# EAGLE design tetrabyte (EAGLE 7.7.0)
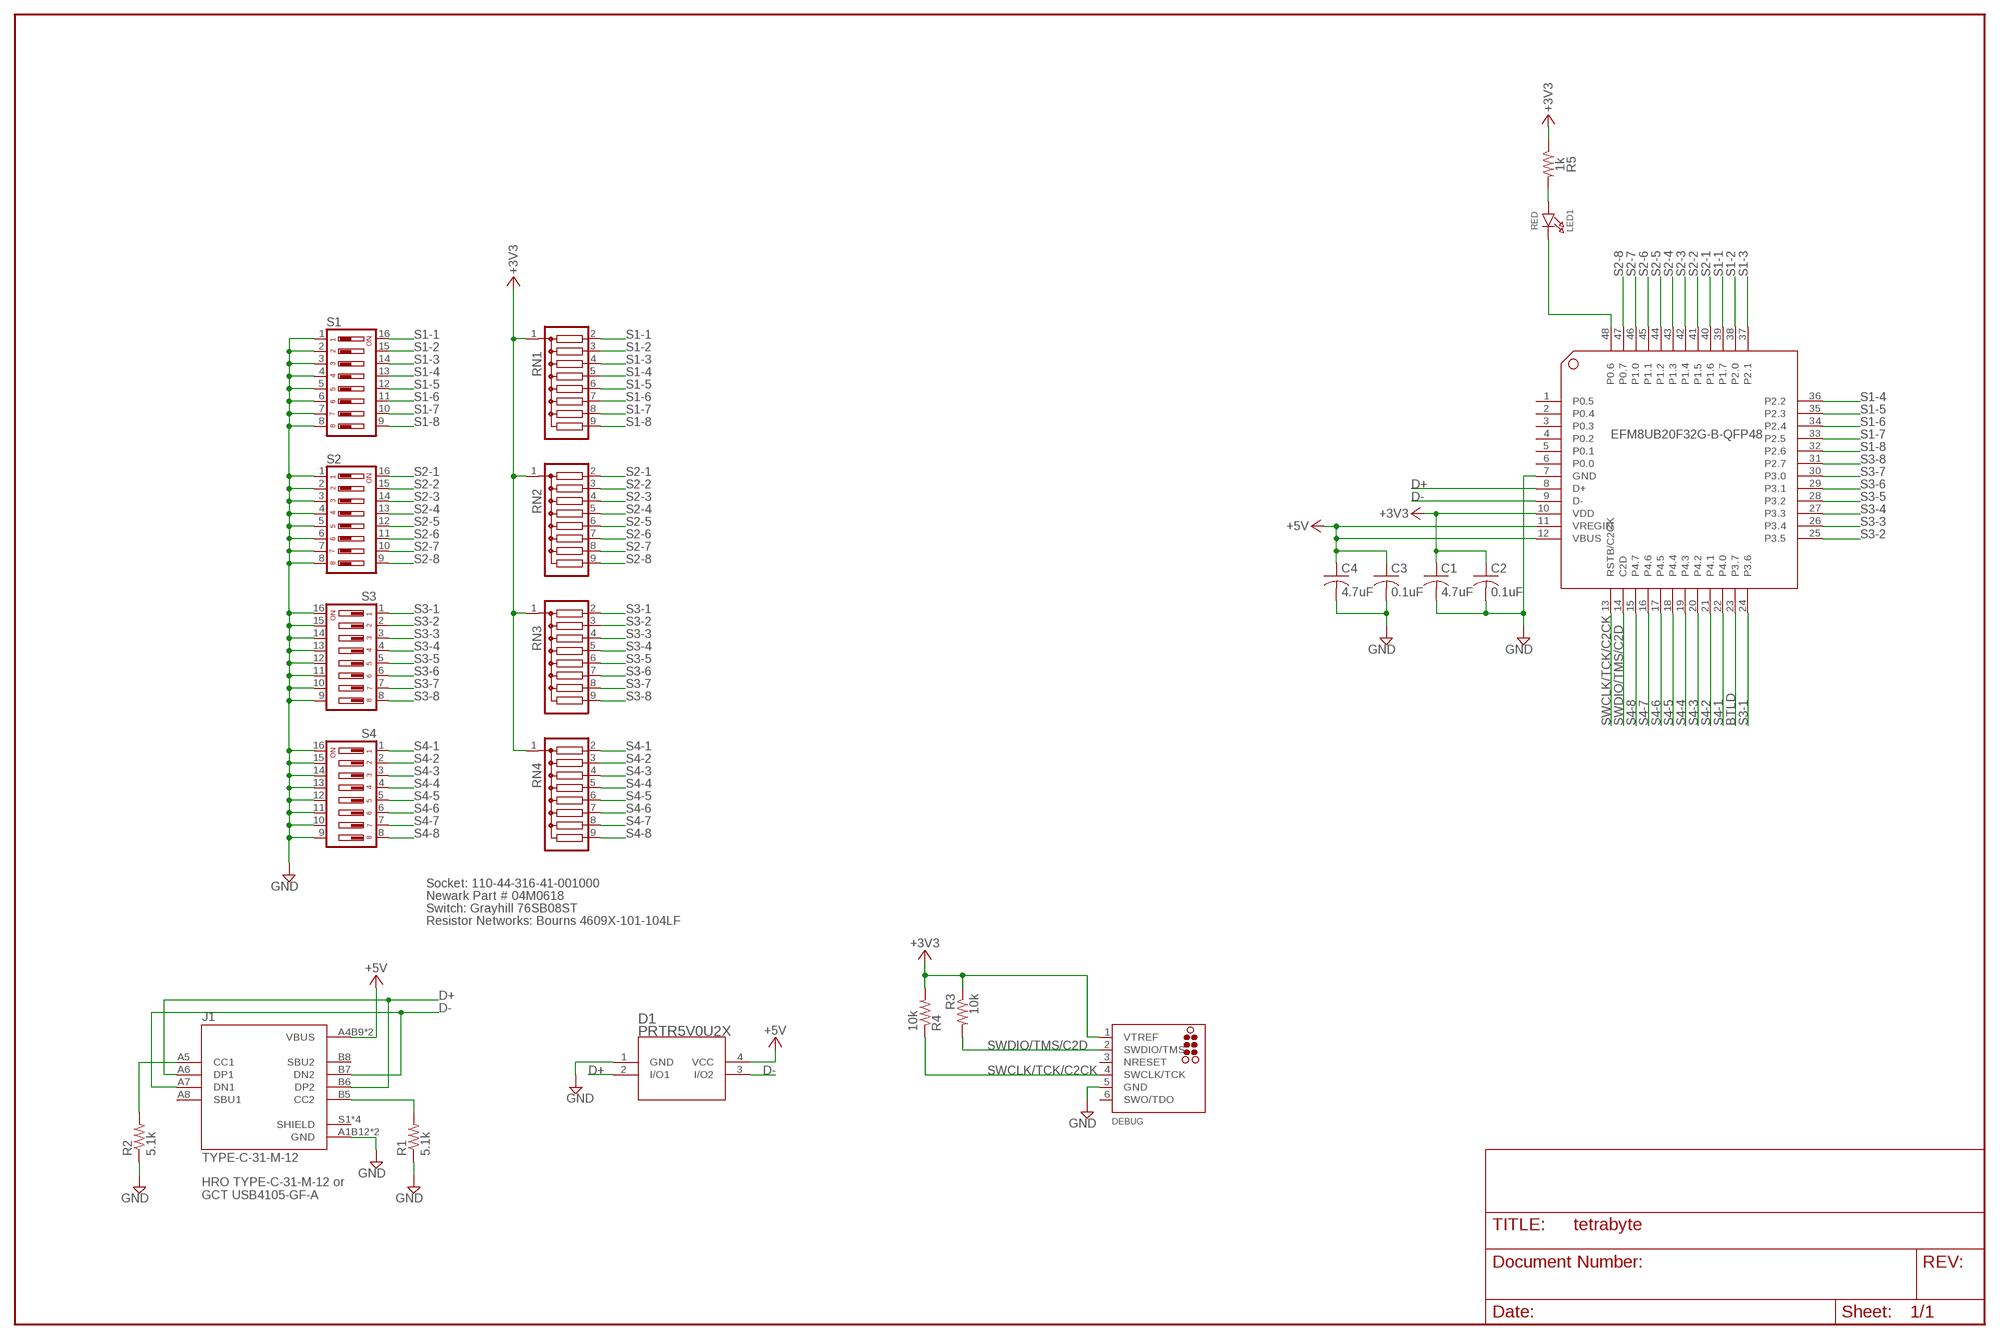
[diagram p0: schematic, sheet 1]

## Parts
C1  4.7uF  C-USC0603K  [C0603K]
C2  0.1uF  C-USC0603K  [C0603K]
C3  0.1uF  C-USC0603K  [C0603K]
C4  4.7uF  C-USC0603K  [C0603K]
D1  PRTR5V0U2X  [SOT143B]
DEBUG  TC2030-CTX-SWD  [TC2030-MCP-NL]
J1  TYPE-C-31-M-12  [HRO_TYPE-C-31-M-12]
LED1  RED  LED0805_NOOUTLINE  [CHIPLED_0805_NOOUTLINE]
R1  5.1k  R-US_R0603  [R0603]
R2  5.1k  R-US_R0603  [R0603]
R3  10k  R-US_R0603  [R0603]
R4  10k  R-US_R0603  [R0603]
R5  1k  R-US_R0603  [R0603]
RN1  G08R  [SIL9]
RN2  G08R  [SIL9]
RN3  G08R  [SIL9]
RN4  G08R  [SIL9]
S1  DS08  [DS-08]
S2  DS08  [DS-08]
S3  DS08  [DS-08]
S4  DS08  [DS-08]
U1  EFM8UB20F64G-B-QFP48  [EFM8UB2-QFP48]

## Nets
+3V3: C1.1 C2.1 DEBUG.1(VTREF) R3.1 R4.2 R5.1 RN1.1 RN2.1 RN3.1 RN4.1 U1.10(VDD)
+5V: C3.1 C4.1 D1.4(VCC) J1.A4B9(VBUS) J1.B4A9(VBUS) U1.11(VREGIN) U1.12(VBUS)
BTLD: U1.23(P3.7)
D+: D1.2(I/O1) J1.A6(DP1) J1.B6(DP2) U1.8(D+)
D-: D1.3(I/O2) J1.A7(DN1) J1.B7(DN2) U1.9(D-)
GND: C1.2 C2.2 C3.2 C4.2 D1.1(GND) DEBUG.5(GND) J1.A1B12(GND) J1.B1A12(GND) R1.1 R2.1 S1.1 S1.2 S1.3 S1.4 S1.5 S1.6 S1.7 S1.8 S2.1 S2.2 S2.3 S2.4 S2.5 S2.6 S2.7 S2.8 S3.9 S3.10 S3.11 S3.12 S3.13 S3.14 S3.15 S3.16 S4.9 S4.10 S4.11 S4.12 S4.13 S4.14 S4.15 S4.16 U1.7(GND)
N$3: LED1.A R5.2
N$19: LED1.C U1.48(P0.6)
N$20: J1.B5(CC2) R1.2
N$21: J1.A5(CC1) R2.2
S1-1: RN1.2 S1.16 U1.39(P1.7)
S1-2: RN1.3 S1.15 U1.38(P2.0)
S1-3: RN1.4 S1.14 U1.37(P2.1)
S1-4: RN1.5 S1.13 U1.36(P2.2)
S1-5: RN1.6 S1.12 U1.35(P2.3)
S1-6: RN1.7 S1.11 U1.34(P2.4)
S1-7: RN1.8 S1.10 U1.33(P2.5)
S1-8: RN1.9 S1.9 U1.32(P2.6)
S2-1: RN2.2 S2.16 U1.40(P1.6)
S2-2: RN2.3 S2.15 U1.41(P1.5)
S2-3: RN2.4 S2.14 U1.42(P1.4)
S2-4: RN2.5 S2.13 U1.43(P1.3)
S2-5: RN2.6 S2.12 U1.44(P1.2)
S2-6: RN2.7 S2.11 U1.45(P1.1)
S2-7: RN2.8 S2.10 U1.46(P1.0)
S2-8: RN2.9 S2.9 U1.47(P0.7)
S3-1: RN3.2 S3.1 U1.24(P3.6)
S3-2: RN3.3 S3.2 U1.25(P3.5)
S3-3: RN3.4 S3.3 U1.26(P3.4)
S3-4: RN3.5 S3.4 U1.27(P3.3)
S3-5: RN3.6 S3.5 U1.28(P3.2)
S3-6: RN3.7 S3.6 U1.29(P3.1)
S3-7: RN3.8 S3.7 U1.30(P3.0)
S3-8: RN3.9 S3.8 U1.31(P2.7)
S4-1: RN4.2 S4.1 U1.22(P4.0)
S4-2: RN4.3 S4.2 U1.21(P4.1)
S4-3: RN4.4 S4.3 U1.20(P4.2)
S4-4: RN4.5 S4.4 U1.19(P4.3)
S4-5: RN4.6 S4.5 U1.18(P4.4)
S4-6: RN4.7 S4.6 U1.17(P4.5)
S4-7: RN4.8 S4.7 U1.16(P4.6)
S4-8: RN4.9 S4.8 U1.15(P4.7)
SWCLK/TCK/C2CK: DEBUG.4(SWCLK/TCK) R4.1 U1.13(RSTB/C2CK)
SWDIO/TMS/C2D: DEBUG.2(SWDIO/TMS) R3.2 U1.14(C2D)
Unconnected: DEBUG.6(SWO/TDO) J1.A8(SBU1) J1.B8(SBU2) J1.S1(SHIELD) J1.S2(SHIELD) J1.S3(SHIELD) J1.S4(SHIELD) U1.1(P0.5) U1.2(P0.4) U1.3(P0.3) U1.4(P0.2) U1.5(P0.1) U1.6(P0.0)

## Notes on the sheet
- EFM8UB20F32G-B-QFP48
- Socket: 110-44-316-41-001000
- Newark Part # 04M0618
- Switch: Grayhill 76SB08ST
- Resistor Networks: Bourns 4609X-101-104LF
- HRO TYPE-C-31-M-12 or
  GCT USB4105-GF-A

## Power pins joined to a net without a drawn wire
NRESET: DEBUG.3(NRESET)

## Library data of the parts
C1-C4 = rcl:C-US: CAPACITOR, American symbol
D1 = Nexperia_PRTR5V0U2X,215:PRTR5V0U2X; MANUFACTURER_PART_NUMBER: PRTR5V0U2X; VENDOR: NXP
DEBUG = tag-connect:TC2030-CTX-SWD
J1 = TYPE-C-31-M-12-OSHPARK:TYPE-C-31-M-12: USB Connectors 24 Receptacle 1 8.94*7.3mm RoHS; AVAILABILITY: Unavailable; DESCRIPTION: USB Connectors 24 Receptacle 1 8.94*7.3mm RoHS; MF: HRO Electronics Co., Ltd.; MP: TYPE-C-31-M-12; PACKAGE: Package; PRICE: None
LED1 = microbuilder:LED: LED 0603 - 0603 Surface Mount Package 2mA: Green LED - Low Power (3.9mcd, 2ma, 1.7Vf) - Digikey: 475-2709-2-ND Orange LED - Low Power (9.8mcd, 2ma, 1.8Vf) - Digikey: 475-1194-2-ND Red LED - Low Power (5mcd, 2ma, 1.8Vf) - Digikey: 475-1195-2-ND Yellow LED - Low Power (7mcd, 2ma, 1.8Vf) - Digikey: 475-1196-2-ND 5mA: Blue LED - Low Power (17mcd, 5ma, 2.9Vf) - Digikey: LNJ937W8CRACT-ND 0805 - 0805 Surface Mount Package 2mA: Red LED (8.8mcd, 2mA, 1.8Vf, Clear) - Low Power [Digikey: 475-2510-1-ND] Green LED (5mcd, 2mA, 1.8Vf, Clear) - Low Power [Digikey: 475-2730-1-ND] Yellow LED (11.3mcd, 2mA, 1.8Vf, Clear) - Low Power [Digikey: 475-2555-1-ND] 20mA: Red LED (104mcd, 20mA, Diffused) - LS R976 [Digikey: 475-1278-6-ND] Red LED (12mcd, 20mA, 2.0Vf, Clear) - APT2012EC [Digikey: 754-1128-1-ND] Green LED (15mcd, 20mA, 2.2Vf, Clear) - APT2012GC [Digikey: 754-1131-1-ND] Orange LED (160mcd, 20mA, 2.1Vf, Clear) - APT2012SECK [Digikey: 754-1130-1-ND] 1206 - 1206 Surface Mount Package Green LED (26mcd, 20mA, Diffused) - LG N971 [Digikey: 475-1407-6-ND] Red LED (15mcd, 20mA, Diffused) - LH N974 [Digikey: 475-1416-6-ND] Cree - Cree High-Power Surface Mount LEDs XPEBWT-L1-0000-00D50 - White 111lm 350mA 2.9Vf 6200K 110° XTEAWT-00-0000-00000LEE3 - White 114lm 350mA 2.85Vf 5000K 115° Everlight - Everlight 45-21 Series Surface Mount LEDs 45-21/QK2C-B2832AC2CB2/2T - Warm White 2000mcd 20mA 3.25Vf 3050K 120° 45-21/LK2C-B38452C4CB2/2T - Nuetral White 2000mcd 20mA 3.25Vf 4150K 120° 45-21/LK2C-B50634C6CB2/2T - Cold White 2200mcd 20mA 3.25Vf 5650K 120° PLCC2 Reverse Mount LS T77K-J1L2-1-0-2-R18-Z - Red 11.25mcd 2mA 1.8Vf 630nm 120° LO T77K-L1M2-24-Z - Orange 19.6mcd 2mA 1.8Vf 606nm 120° LY T77K-K2M1-26-Z - Yellow 15.7mcd 2mA 1.8Vf 587nm 120°
R1-R5 = rcl:R-US_: RESISTOR, American symbol
RN1-RN4 = resistor-sil:G08R: SIL RESISTOR; OC_FARNELL: unknown; OC_NEWARK: unknown
S1-S4 = switch-dil:DS08: DIL/CODE SWITCH; MPN: DS08; OC_FARNELL: unknown; OC_NEWARK: 73J0071
U1 = Glen-EFM8UB2:EFM8UB20F64G-B-QFP48

## Board
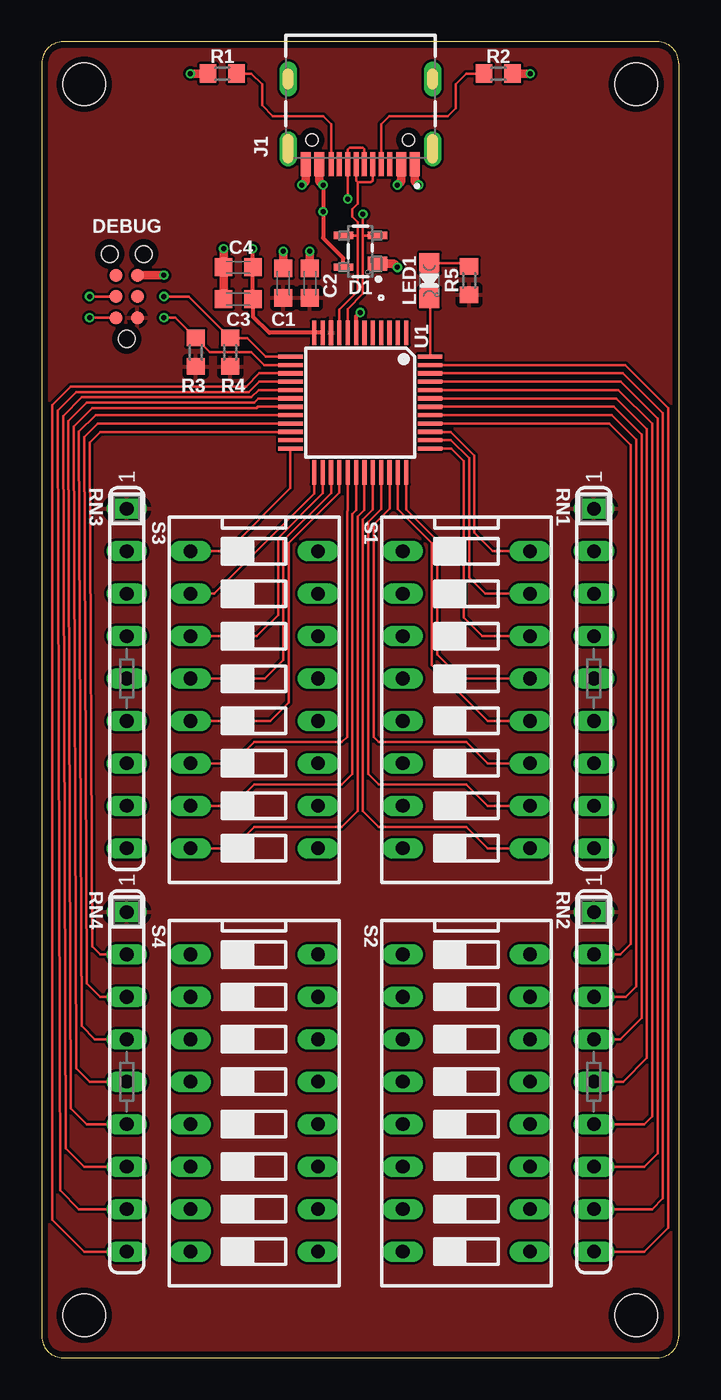
[diagram p1: board, top side]
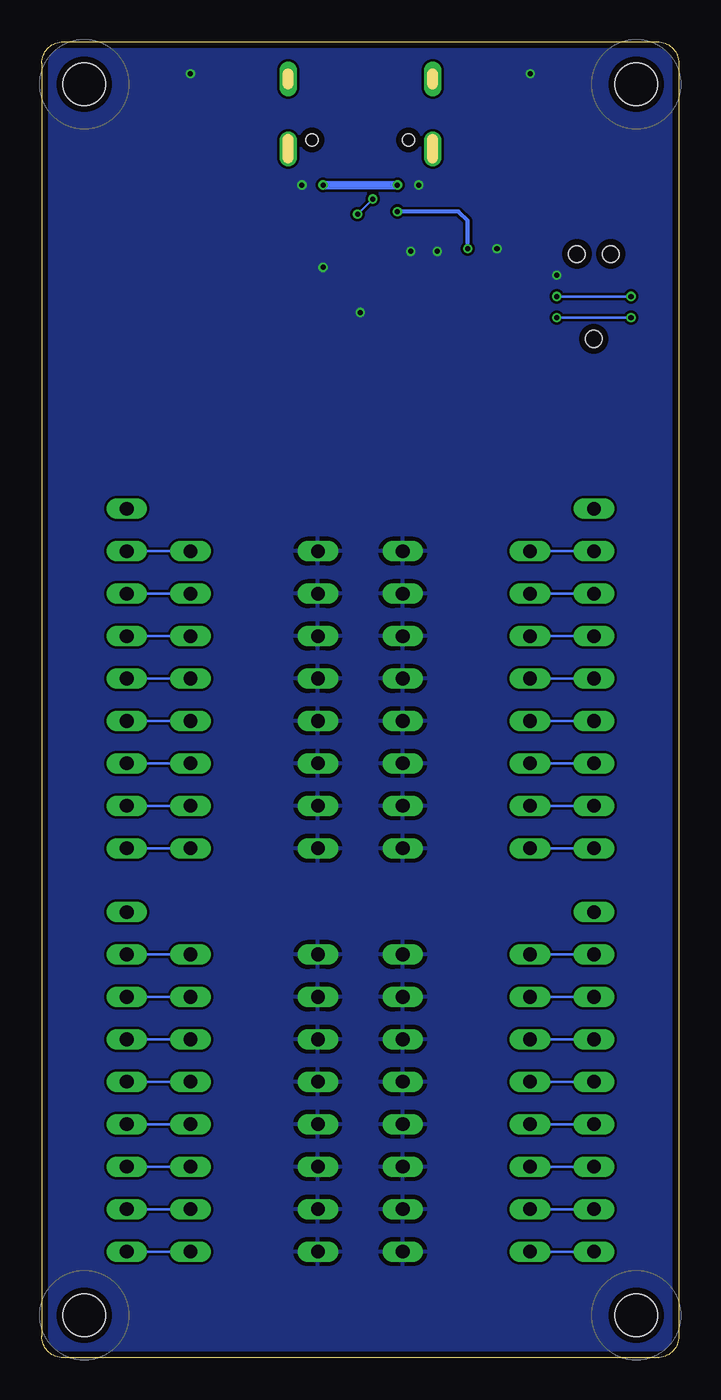
[diagram p2: board, bottom side, seen from below]

Size 38.1 x 78.74 mm. Coordinates in mm from the lower left corner, seen from the top.
Outline: 36.83,0 arc90 38.1,1.27 38.1,77.47 arc90 36.83,78.74 1.27,78.74 arc90 0,77.47 0,1.27 arc90 1.27,0 36.83,0
Copper layers (1*16): Top 0.035559375mm / dielectric 1.6mm / Bottom 0.035559375mm
Design rules "oshpark-2layer-2018": minimum track width 6mil, minimum drill 10mil, track to track 6mil, track to pad 6mil, pad to pad 6mil, via to via 6mil, smd to smd 6mil, copper to edge 15mil, drill to drill 6mil, minimum pad ring 5mil, minimum via ring 5mil, stop-mask expansion 2.5mil, vias tented up to drill 0mil, thermal gap 10mil
Holes 2.54 mm at 35.56,2.54 2.54,2.54 35.56,76.2 2.54,76.2
tKeepout: area 33,0 to 38.1,5.1; area 0,0 to 5.1,5.1; area 0,73.7 to 5.1,78.7; area 33,73.7 to 38.1,78.7
bKeepout: area 33.6,0 to 38.1,4.5; area 0,0 to 4.5,4.5; area 0,74.2 to 4.5,78.7; area 33.6,74.2 to 38.1,78.7

### Footprints (pad centres in the part's own frame; a part is rotated, then mirrored left to right if it is on the bottom)
C0603K = smd 1.05 x 1.08: 1 -0.875,0; 2 0.875,0
SOT143B = smd 0.838 x 1.168: 1 -0.747,-1.016 | smd 0.432 x 1.168: 2 0.95,-1.016; 3 0.95,1.016; 4 -0.95,1.016
TC2030-MCP-NL = smd 0.787 x 0.787: 1 1.27,-0.635; 2 1.27,0.635; 3 2.54,-0.635; 4 2.54,0.635; 5 3.81,-0.635; 6 3.81,0.635 | hole 0.991: 0,0; 5.08,-1.016; 5.08,1.016
HRO_TYPE-C-31-M-12 = smd 0.6 x 1.45: A1B12 -3.25,5.095; A4B9 -2.45,5.095; B1A12 3.25,5.095; B4A9 2.45,5.095 | smd 0.3 x 1.45: A5 -1.25,5.095; A6 -0.25,5.095; A7 0.25,5.095; A8 1.25,5.095; B5 1.75,5.095; B6 0.75,5.095; B7 -0.75,5.095; B8 -1.75,5.095 | drill 0.65 pad 1.05 long: S1 -4.32,4.18; S2 4.32,4.18; S3 -4.32,0; S4 4.32,0 | hole 0.7: -2.89,3.65; 2.89,3.65
CHIPLED_0805_NOOUTLINE = smd 1.2 x 1.2: A 0,-1.05; C 0,1.05
R0603 = smd 1 x 1.1: 1 -0.85,0; 2 0.85,0
SIL9 = drill 0.813 long: 1 -10.16,0; 2 -7.62,0; 3 -5.08,0; 4 -2.54,0; 5 0,0; 6 2.54,0; 7 5.08,0; 8 7.62,0; 9 10.16,0
DS-08 = drill 0.813 long: 1 -8.89,-3.81; 2 -6.35,-3.81; 3 -3.81,-3.81; 4 -1.27,-3.81; 5 1.27,-3.81; 6 3.81,-3.81; 7 6.35,-3.81; 8 8.89,-3.81; 9 8.89,3.81; 10 6.35,3.81; 11 3.81,3.81; 12 1.27,3.81; 13 -1.27,3.81; 14 -3.81,3.81; 15 -6.35,3.81; 16 -8.89,3.81
EFM8UB2-QFP48 = smd 1.45 x 0.25: 1 -4.175,2.75; 2 -4.175,2.25; 3 -4.175,1.75; 4 -4.175,1.25; 5 -4.175,0.75; 6 -4.175,0.25; 7 -4.175,-0.25; 8 -4.175,-0.75; 9 -4.175,-1.25; 10 -4.175,-1.75; 11 -4.175,-2.25; 12 -4.175,-2.75; 25 4.175,-2.75; 26 4.175,-2.25; 27 4.175,-1.75; 28 4.175,-1.25; 29 4.175,-0.75; 30 4.175,-0.25; 31 4.175,0.25; 32 4.175,0.75; 33 4.175,1.25; 34 4.175,1.75; 35 4.175,2.25; 36 4.175,2.75 | smd 0.25 x 1.45: 13 -2.75,-4.175; 14 -2.25,-4.175; 15 -1.75,-4.175; 16 -1.25,-4.175; 17 -0.75,-4.175; 18 -0.25,-4.175; 19 0.25,-4.175; 20 0.75,-4.175; 21 1.25,-4.175; 22 1.75,-4.175; 23 2.25,-4.175; 24 2.75,-4.175; 37 2.75,4.175; 38 2.25,4.175; 39 1.75,4.175; 40 1.25,4.175; 41 0.75,4.175; 42 0.25,4.175; 43 -0.25,4.175; 44 -0.75,4.175; 45 -1.25,4.175; 46 -1.75,4.175; 47 -2.25,4.175; 48 -2.75,4.175

### Placement (x,y rotation side)
C1  14.45,64.29 90 top
C2  16.03,64.29 90 top
C3  11.75,63.34 180 top
C4  11.75,65.25 180 top
D1  19.05,66.2 90 top
DEBUG  5.08,60.96 90 top
J1  19.05,76.52 180 top
LED1  23.18,64.45 180 top
R1  10.79,76.83 0 top
R2  27.3,76.83 180 top
R3  9.21,60.17 90 top
R4  11.27,60.17 270 top
R5  25.56,64.45 90 top
RN1  33.02,40.64 270 top
RN2  33.02,16.51 270 top
RN3  5.08,40.64 270 top
RN4  5.08,16.51 270 top
S1  25.4,39.37 270 top
S2  25.4,15.24 270 top
S3  12.7,39.37 270 top
S4  12.7,15.24 270 top
U1  19.05,57.15 270 top

### Tracks (layer width: path | path; a pad name or v marks a point on that pad's centre or on a via)
+3V3
  pour Top (isolate 0.152): 38.1,0 0,0 0,78.74 38.1,78.74
+5V  (via drill 0.3)
  Top 0.254: D1.4 18.03,65.79 16.83,66.99 v16.83,68.58 v16.83,70.17 | v12.62,66.36 C4.1 C3.1 12.62,62.31 13.61,61.33 U1.12 U1.11
  Top 0.508: J1.B4A9 16.6,70.39 v16.83,70.17 | J1.A4B9 21.5,70.39 v21.27,70.17
  Bottom 0.254: v16.83,68.58 13.18,68.58 12.62,68.03 v12.62,66.36
  Bottom 0.508: v16.83,70.17 v21.27,70.17
D+  (via drill 0.3)
  Top 0.152: U1.8 18.3,62.75 19.21,63.66 19.21,67.15 | J1.A6 19.3,72.3 19.21,72.39 18.41,72.39 18.3,72.28 J1.B6 v18.3,69.33 | 19.21,67.31 19.21,67.15 | v19.21,68.42 19.21,67.15 | D1.2 19.21,67.15
  Bottom 0.152: v18.3,69.33 v19.21,68.42
D-
  Top 0.152: U1.9 17.8,62.73 18.89,63.82 18.89,67.15 | D1.3 18.73,67.15 18.89,67.15 | J1.B7 19.8,70.44 19.68,70.33 18.89,70.33 | J1.A7 18.8,70.42 18.89,70.33 | 18.89,67.15 18.89,67.94 18.57,68.26 18.57,68.74 18.89,69.06 18.89,70.33
GND  (via drill 0.3)
  Top 0.254: U1.7 18.8,62.3 v19.05,62.55
  Top 0.508: R1.1 v8.89,76.83 | R2.1 v29.21,76.83 | D1.1 21.07,65.45 v21.27,65.25 | C3.2 C4.2 v10.87,66.36 | C1.2 v14.45,66.2 | C2.2 v16.03,66.2 | J1.B1A12 15.8,70.41 v15.56,70.17 | J1.A1B12 22.3,70.41 v22.54,70.17 | DEBUG.5 v7.3,64.77
  pour Bottom (isolate 0.152): 38.1,0 0,0 0,78.74 38.1,78.74
N$3
  Top 0.152: LED1.A 25.36,65.5 R5.2
N$19
  Top 0.152: U1.48 23.23,63.35 LED1.C
N$20
  Top 0.152: R1.2 12.54,76.83 13.18,76.2 13.18,74.93 13.81,74.3 16.83,74.3 17.3,73.82 J1.B5
N$21
  Top 0.152: J1.A5 20.3,73.8 20.8,74.3 24.29,74.3 24.77,74.77 24.77,76.2 25.4,76.83 R2.2
S1-1
  Top 0.152: S1.16 26.99,48.26 25.88,49.37 25.88,53.98 24.45,55.4 U1.39
  Bottom 0.152: S1.16 RN1.2
S1-2
  Top 0.152: S1.15 26.51,45.72 25.56,46.67 25.56,53.82 24.48,54.9 U1.38
  Bottom 0.152: S1.15 RN1.3
S1-3
  Top 0.152: S1.14 26.35,43.18 25.24,44.29 25.24,53.66 24.5,54.4 U1.37
  Bottom 0.152: RN1.4 S1.14
S1-4
  Top 0.152: S1.13 25.08,40.64 23.65,42.07 23.65,48.9 21.8,50.75 U1.36
  Bottom 0.152: S1.13 RN1.5
S1-5
  Top 0.152: U1.35 21.3,50.77 23.34,48.74 23.34,41.43 26.67,38.1 S1.12
  Bottom 0.152: RN1.6 S1.12
S1-6
  Top 0.152: S1.11 26.67,35.56 25.4,36.83 20.16,36.83 19.84,37.15 19.84,49.85 20.8,50.8 U1.34
  Bottom 0.152: S1.11 RN1.7
S1-7
  Top 0.152: S1.10 26.67,33.02 25.4,34.29 20.16,34.29 19.53,34.92 19.53,50.01 20.3,50.78 U1.33
  Bottom 0.152: RN1.8 S1.10
S1-8
  Top 0.152: S1.9 26.67,30.48 25.4,31.75 20.16,31.75 19.21,32.7 19.21,50.16 19.8,50.76 U1.32
  Bottom 0.152: S1.9 RN1.9
S2-1
  Top 0.152: U1.40 33.95,55.9 35.24,54.61 35.24,24.77 34.61,24.13 RN2.2
  Bottom 0.152: RN2.2 S2.16
S2-2
  Top 0.152: U1.41 34.09,56.4 35.56,54.93 35.56,22.23 34.92,21.59 RN2.3
  Bottom 0.152: RN2.3 S2.15
S2-3
  Top 0.152: U1.42 34.22,56.9 35.88,55.24 35.88,20.32 34.61,19.05 RN2.4
  Bottom 0.152: S2.14 RN2.4
S2-4
  Top 0.152: U1.43 34.36,57.4 36.2,55.56 36.2,17.94 34.77,16.51 RN2.5
  Bottom 0.152: S2.13 RN2.5
S2-5
  Top 0.152: U1.44 34.49,57.9 36.51,55.88 36.51,14.45 36.04,13.97 RN2.6
  Bottom 0.152: RN2.6 S2.12
S2-6
  Top 0.152: U1.45 34.63,58.4 36.83,56.2 36.83,12.22 36.04,11.43 RN2.7
  Bottom 0.152: S2.11 RN2.7
S2-7
  Top 0.152: U1.46 34.76,58.9 37.15,56.52 37.15,9.53 36.51,8.89 RN2.8
  Bottom 0.152: S2.10 RN2.8
S2-8
  Top 0.152: U1.47 34.9,59.4 37.47,56.83 37.47,7.78 36.04,6.35 RN2.9
  Bottom 0.152: RN2.9 S2.9
S3-1
  Top 0.152: S3.1 11.11,48.26 14.88,52.02 U1.24
  Bottom 0.152: RN3.2 S3.1
S3-2
  Top 0.152: S3.2 10.32,45.72 16.3,51.7 U1.25
  Bottom 0.152: RN3.3 S3.2
S3-3
  Top 0.152: S3.3 12.86,43.18 14.13,44.45 14.13,49.05 16.8,51.73 U1.26
  Bottom 0.152: RN3.4 S3.3
S3-4
  Top 0.152: U1.27 17.3,51.75 14.45,48.9 14.45,41.75 13.34,40.64 S3.4
  Bottom 0.152: RN3.5 S3.4
S3-5
  Top 0.152: S3.5 13.65,38.1 14.76,39.21 14.76,48.74 17.8,51.77 U1.28
  Bottom 0.152: RN3.6 S3.5
S3-6
  Top 0.152: S3.6 11.43,35.56 12.7,36.83 17.94,36.83 18.26,37.15 18.26,50.64 18.3,50.69 U1.29
  Bottom 0.152: RN3.7 S3.6
S3-7
  Top 0.152: S3.7 11.43,33.02 12.7,34.29 17.94,34.29 18.57,34.92 18.57,50.48 18.8,50.71 U1.30
  Bottom 0.152: RN3.8 S3.7
S3-8
  Top 0.152: S3.8 11.43,30.48 12.7,31.75 17.94,31.75 18.89,32.7 18.89,50.32 19.3,50.73 U1.31
  Bottom 0.152: RN3.9 S3.8
S4-1
  Top 0.152: U1.22 3.49,55.4 2.86,54.77 3.02,24.61 3.49,24.13 RN4.2
  Bottom 0.152: RN4.2 S4.1
S4-2
  Top 0.152: U1.21 3.35,55.9 2.54,55.09 2.7,22.38 3.49,21.59 RN4.3
  Bottom 0.152: RN4.3 S4.2
S4-3
  Top 0.152: U1.20 3.22,56.4 2.22,55.4 2.38,19.84 3.17,19.05 RN4.4
  Bottom 0.152: RN4.4 S4.3
S4-4
  Top 0.152: U1.19 12.93,56.9 12.86,56.83 3.02,56.83 1.91,55.72 2.06,17.3 2.86,16.51 RN4.5
  Bottom 0.152: RN4.5 S4.4
S4-5
  Top 0.152: U1.18 12.95,57.4 12.7,57.15 2.7,57.15 1.59,56.04 1.75,14.92 2.7,13.97 RN4.6
  Bottom 0.152: RN4.6 S4.5
S4-6
  Top 0.152: U1.17 12.97,57.9 12.54,57.47 2.38,57.47 1.27,56.36 1.43,12.54 2.54,11.43 RN4.7
  Bottom 0.152: RN4.7 S4.6
S4-7
  Top 0.152: U1.16 13,58.4 12.38,57.78 2.06,57.78 0.95,56.67 1.11,10 2.22,8.89 RN4.8
  Bottom 0.152: RN4.8 S4.7
S4-8
  Top 0.152: U1.15 13.02,58.9 12.22,58.1 1.75,58.1 0.64,56.99 0.64,8.26 2.54,6.35 RN4.9
  Bottom 0.152: RN4.9 S4.8
SWCLK/TCK/C2CK  (via drill 0.3)
  Top 0.152: DEBUG.4 v2.86,63.5 | U1.13 13.4,59.9 12.28,61.02 R4.1 8.79,63.5 v7.3,63.5
  Bottom 0.152: v2.86,63.5 v7.3,63.5
SWDIO/TMS/C2D  (via drill 0.3)
  Top 0.152: DEBUG.2 v2.86,62.23 | U1.14 13.31,59.4 12.54,60.17 10.06,60.17 R3.2 7.99,62.23 v7.3,62.23
  Bottom 0.152: v2.86,62.23 v7.3,62.23

### Text on the board
_tsilk: R1 | R2 | J1 | DEBUG | C4 | C2 | D1 | LED1 | R5 | C3 | C1 | U1 | R3 | R4 | RN3 | RN1 | S3 | S1 | RN4 | RN2 | S4 | S2